# EAGLE design superprobe (EAGLE 6.6.0)
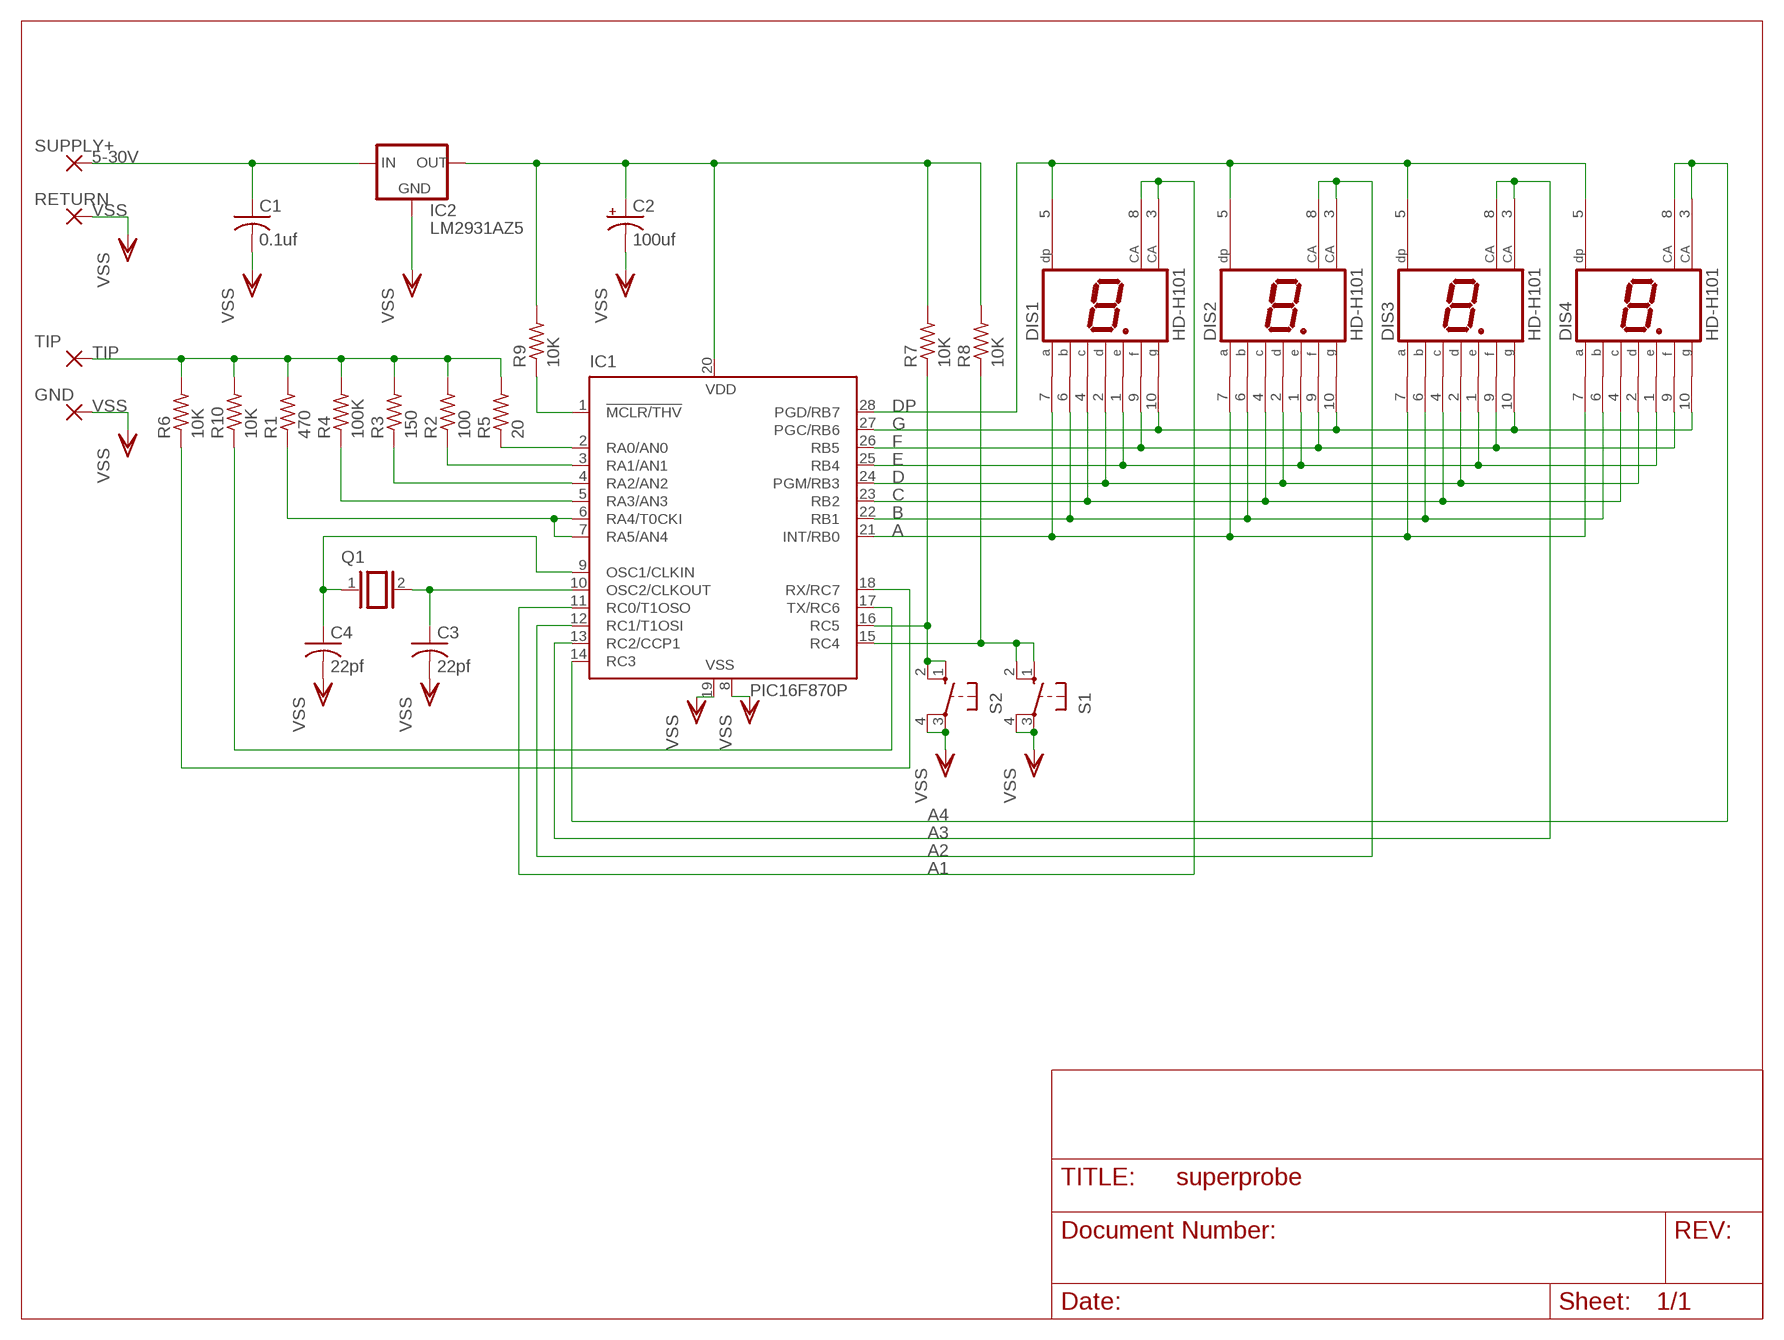
[diagram p0: schematic, sheet 1]

## Parts
C1  0.1uf  C-US050-025X075  [C050-025X075]
C2  100uf  CPOL-USE15-6AXIAL  [E15-6]
C3  22pf  C-US050-025X075  [C050-025X075]
C4  22pf  C-US050-025X075  [C050-025X075]
DIS1  HD-H101  [HDSP-M]
DIS2  HD-H101  [HDSP-M]
DIS3  HD-H101  [HDSP-M]
DIS4  HD-H101  [HDSP-M]
GND  PAD-0520  [0520]
IC1  PIC16F870P  [DIL28-3]
IC2  LM2931AZ5  XC63FPL  [TO92]
Q1  XTAL/S  [QS]
R1  470  R-US_0207/10  [0207/10]
R2  100  R-US_0207/10  [0207/10]
R3  150  R-US_0207/10  [0207/10]
R4  100K  R-US_0207/10  [0207/10]
R5  20  R-US_0207/10  [0207/10]
R6  10K  R-US_0207/10  [0207/10]
R7  10K  R-US_0207/10  [0207/10]
R8  10K  R-US_0207/10  [0207/10]
R9  10K  R-US_0207/10  [0207/10]
R10  10K  R-US_0207/10  [0207/10]
RETURN  PAD-0520  [0520]
S1  40-XX  [B3F-40XX]
S2  40-XX  [B3F-40XX]
SUPPLY+  PAD-0520  [0520]
TIP  PAD-0520  [0520]

## Nets
5-30V [supply]: C1.1 IC2.1(IN) SUPPLY+.P$1(P)
A: DIS1.7(A) DIS2.7(A) DIS3.7(A) DIS4.7(A) IC1.21(INT/RB0)
A1: DIS1.3(CA) DIS1.8(CA) IC1.11(RC0/T1OSO)
A2: DIS2.3(CA) DIS2.8(CA) IC1.12(RC1/T1OSI)
A3: DIS3.3(CA) DIS3.8(CA) IC1.13(RC2/CCP1)
A4: DIS4.3(CA) DIS4.8(CA) IC1.14(RC3)
B: DIS1.6(B) DIS2.6(B) DIS3.6(B) DIS4.6(B) IC1.22(RB1)
C: DIS1.4(C) DIS2.4(C) DIS3.4(C) DIS4.4(C) IC1.23(RB2)
D: DIS1.2(D) DIS2.2(D) DIS3.2(D) DIS4.2(D) IC1.24(PGM/RB3)
DP: DIS1.5(DP) DIS2.5(DP) DIS3.5(DP) DIS4.5(DP) IC1.28(PGD/RB7)
E: DIS1.1(E) DIS2.1(E) DIS3.1(E) DIS4.1(E) IC1.25(RB4)
F: DIS1.9(F) DIS2.9(F) DIS3.9(F) DIS4.9(F) IC1.26(RB5)
G: DIS1.10(G) DIS2.10(G) DIS3.10(G) DIS4.10(G) IC1.27(PGC/RB6)
N$1: IC1.1(!MCLR/THV) R9.1
N$2: IC1.2(RA0/AN0) R5.1
N$3: IC1.6(RA4/T0CKI) IC1.7(RA5/AN4) R1.1
N$4: IC1.5(RA3/AN3) R4.1
N$5: IC1.4(RA2/AN2) R3.1
N$6: IC1.3(RA1/AN1) R2.1
N$7: IC1.16(RC5) R7.1 S2.1(S) S2.2(S1)
N$9: IC1.15(RC4) R8.1 S1.1(S) S1.2(S1)
N$10: IC1.18(RX/RC7) R6.1
N$11: IC1.17(TX/RC6) R10.1
N$12: C4.1 IC1.9(OSC1/CLKIN) Q1.1
N$13: C3.1 IC1.10(OSC2/CLKOUT) Q1.2
TIP: R1.2 R2.2 R3.2 R4.2 R5.2 R6.2 R10.2 TIP.P$1(P)
VDD [supply]: C2.+ IC1.20(VDD) IC2.3(OUT) R7.2 R8.2 R9.2
VSS [supply]: C1.2 C2.- C3.2 C4.2 GND.P$1(P) IC1.8(VSS) IC1.19(VSS) IC2.2(GND) RETURN.P$1(P) S1.3(P) S1.4(P1) S2.3(P) S2.4(P1)

## Library data of the parts
C1 C3 C4 = rcl:C-US: CAPACITOR, American symbol
C2 = rcl:CPOL-US: POLARIZED CAPACITOR, American symbol
DIS1-DIS4 = display-hp:HD-H101: LED DISPLAY 1-character 7 segment, decimal point right; OC_FARNELL: unknown; OC_NEWARK: unknown
GND RETURN SUPPLY+ TIP = dec-con:PAD: WIRE PAD Standard US Drill Sizes
IC1 = microchip:PIC16*870: MICROCONTROLLER flash type; MF: MICROCHIP; MPN: PIC16F870-I/SP; OC_FARNELL: 9760954; OC_NEWARK: 19C7275
IC2 = v-reg:XC63FP: Positiv Voltage Regulators www.torex.co.jp/english/product/pro02/pdf/0201_xc62fp.pdf
Q1 = special:XTAL/S: CRYSTAL
R1-R10 = rcl:R-US_: RESISTOR, American symbol
S1 S2 = switch-omron:40-XX: OMRON SWITCH; MF: OMRON COMPONENTS USA; MPN: B3F-4000; OC_FARNELL: 176434; OC_NEWARK: 36K3105

## Net classes
1 supply: width 0.508 mm

## Board
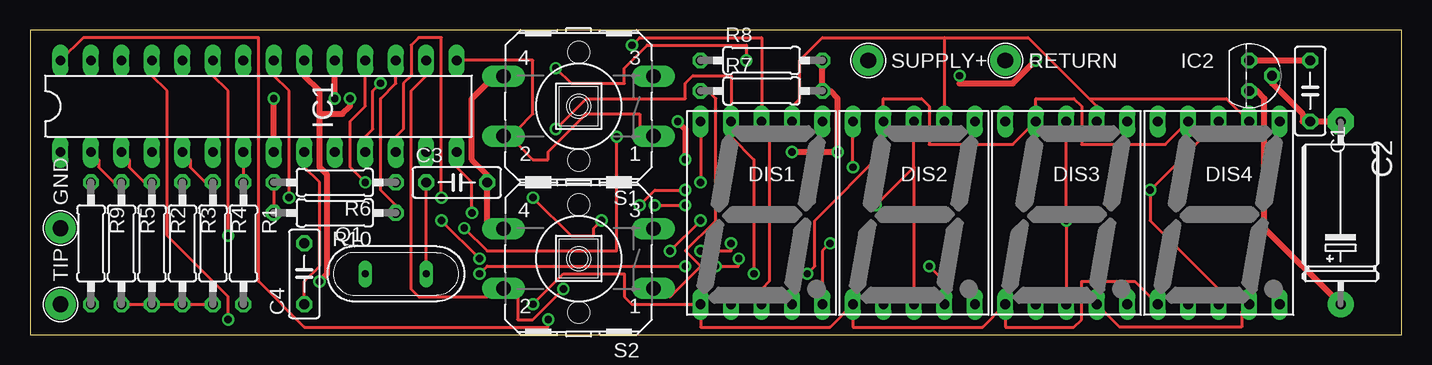
[diagram p1: board, top side]
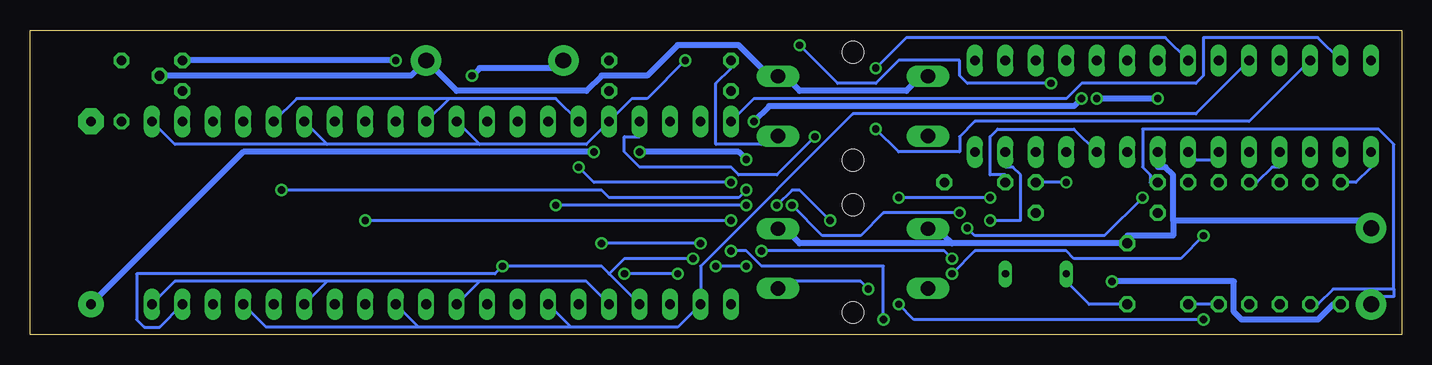
[diagram p2: board, bottom side, seen from below]

Size 114.3 x 25.4 mm. Coordinates in mm from the lower left corner, seen from the top.
Outline: 0,0 114.3,0 114.3,25.4 0,25.4 0,0
Copper layers (1*16): Top 0.035mm / dielectric 1.5mm / Bottom 0.035mm
Design rules "default": minimum track width 10mil, minimum drill 24mil, track to track 8mil, track to pad 8mil, pad to pad 8mil, via to via 8mil, smd to smd 8mil, copper to edge 20mil, drill to drill 8mil, minimum pad ring 10mil, minimum via ring 8mil, stop-mask expansion 4mil, vias tented up to drill 0mil, thermal gap 10mil

### Footprints (pad centres in the part's own frame; a part is rotated, then mirrored left to right if it is on the bottom)
C050-025X075 = drill 0.813 octagon: 1 -2.54,0; 2 2.54,0
E15-6 = drill 0.813 pad 2.159: + -7.62,0 | drill 0.813 pad 2.159 octagon: - 7.62,0
HDSP-M = drill 0.813 long: 1 -5.08,-7.62; 2 -2.54,-7.62; 3 0,-7.62; 4 2.54,-7.62; 5 5.08,-7.62; 6 5.08,7.62; 7 2.54,7.62; 8 0,7.62; 9 -2.54,7.62; 10 -5.08,7.62
0520 = drill 1.321 pad 2.54: P$1 0,0
DIL28-3 = drill 0.813 long: 1 -16.51,-3.81; 2 -13.97,-3.81; 3 -11.43,-3.81; 4 -8.89,-3.81; 5 -6.35,-3.81; 6 -3.81,-3.81; 7 -1.27,-3.81; 8 1.27,-3.81; 9 3.81,-3.81; 10 6.35,-3.81; 11 8.89,-3.81; 12 11.43,-3.81; 13 13.97,-3.81; 14 16.51,-3.81; 15 16.51,3.81; 16 13.97,3.81; 17 11.43,3.81; 18 8.89,3.81; 19 6.35,3.81; 20 3.81,3.81; 21 1.27,3.81; 22 -1.27,3.81; 23 -3.81,3.81; 24 -6.35,3.81; 25 -8.89,3.81; 26 -11.43,3.81; 27 -13.97,3.81; 28 -16.51,3.81
TO92 = drill 0.813 octagon: 1 -1.27,0; 2 0,1.905; 3 1.27,0
QS = drill 0.61 long: 1 -2.54,0; 2 2.54,0
0207/10 = drill 0.813 octagon: 1 -5.08,0; 2 5.08,0
B3F-40XX = drill 1.194 long: 1 -6.248,2.489; 2 6.248,2.489; 3 -6.248,-2.489; 4 6.248,-2.489 | hole 1.803: 0,-4.496; 0,4.496

### Placement (x,y rotation side)
C1  106.68,20.32 270 top
C2  109.22,10.16 90 top
C3  35.56,12.7 0 top
C4  22.86,5.08 90 top
DIS1  60.96,10.16 0 top
DIS2  73.66,10.16 0 top
DIS3  86.36,10.16 0 top
DIS4  99.06,10.16 0 top
GND  2.54,8.89 90 top
IC1  19.05,19.05 0 top
IC2  101.6,21.59 270 top
Q1  30.48,5.08 0 top
R1  17.78,7.62 270 top
R2  10.16,7.62 270 top
R3  12.7,7.62 270 top
R4  15.24,7.62 270 top
R5  7.62,7.62 270 top
R6  25.4,12.7 180 top
R7  60.96,20.32 0 top
R8  60.96,22.86 0 top
R9  5.08,7.62 270 top
R10  25.4,10.16 180 top
RETURN  81.28,22.86 0 top
S1  45.72,19.05 180 top
S2  45.72,6.35 180 top
SUPPLY+  69.85,22.86 0 top
TIP  2.54,2.54 90 top

### Tracks (layer width: path | path; a pad name or v marks a point on that pad's centre or on a via)
5-30V  (via drill 0.61)
  Top 0.508: IC2.1 C1.1 | v83.82,22.86 81.92,20.95 77.47,20.95 v77.47,21.59
  Bottom 0.508: v77.47,21.59 76.83,22.23 70.48,22.23 SUPPLY+.P$1 | v83.82,22.86 IC2.1
A  (via drill 0.61)
  Top 0.254: 76.2,24.77 66.04,24.77 64.14,22.86 64.14,19.68 63.5,19.05 DIS1.7 | 76.2,24.77 DIS2.7 | v21.59,11.43 21.59,20.32 20.32,21.59 IC1.21 | v36.2,8.89 38.1,6.99 48.9,6.99 v48.9,16.51 | 88.27,19.68 83.19,24.77 76.2,24.77 | 88.27,19.68 88.9,19.05 DIS3.7 | 88.27,19.68 99.69,19.68 DIS4.7
  Bottom 0.254: v21.59,11.43 24.77,8.26 35.56,8.26 v36.2,8.89 | v48.9,16.51 52.07,13.34 55.24,13.34 55.88,13.97 63.5,13.97 64.77,15.24 64.77,16.51 63.5,16.51 DIS1.7
A1  (via drill 0.61)
  Top 0.254: v29.21,20.95 28.57,20.32 28.57,17.14 27.94,16.51 IC1.11 | v50.16,24.13 50.8,24.77 60.96,24.77 DIS1.8 61.59,17.14 61.59,4.45 60.96,3.81 DIS1.3
  Bottom 0.254: v29.21,20.95 36.2,20.95 36.83,21.59 36.83,22.86 41.91,22.86 43.81,20.95 46.99,20.95 v50.16,24.13
A2  (via drill 0.61)
  Top 0.254: v34.29,11.43 34.29,24.77 32.38,24.77 31.75,24.13 31.75,21.59 31.11,20.95 31.11,17.14 30.48,16.51 IC1.12 | v41.91,11.43 45.09,8.26 46.99,8.26 46.99,8.89 v47.62,9.53 | v52.07,10.79 v54.61,10.79 | v70.48,10.79 73.66,13.97 | 73.66,13.97 DIS2.8 | 73.66,13.97 DIS2.3
  Bottom 0.254: v34.29,11.43 v41.91,11.43 | v47.62,9.53 50.16,12.06 50.8,12.06 v52.07,10.79 | v54.61,10.79 v70.48,10.79
A3  (via drill 0.61)
  Top 0.254: v34.29,9.53 v37.47,6.35 | v53.34,6.99 v55.88,9.53 | DIS3.3 v86.36,9.53 DIS3.8
  Bottom 0.254: v34.29,9.53 31.75,9.53 31.75,13.34 32.38,13.97 33.02,13.97 IC1.13 | v37.47,6.35 38.1,6.99 v53.34,6.99 | v55.88,9.53 v86.36,9.53
A4  (via drill 0.61)
  Top 0.254: v36.83,10.16 36.83,12.7 35.56,13.97 IC1.14 | v50.8,10.79 52.07,12.06 v54.61,12.06 | DIS4.8 v93.34,12.06 93.34,9.53 99.06,3.81 DIS4.3
  Bottom 0.254: v36.83,10.16 43.18,10.16 45.09,8.26 48.26,8.26 v50.8,10.79 | v54.61,12.06 55.24,11.43 66.04,11.43 66.67,12.06 v93.34,12.06
B  (via drill 0.61)
  Top 0.254: v43.81,22.23 45.09,20.95 49.53,20.95 49.53,22.23 51.44,24.13 59.69,24.13 v59.69,22.86
  Bottom 0.254: 76.83,15.88 67.94,15.88 DIS1.6 64.14,19.68 62.87,19.68 v59.69,22.86 | 76.83,15.88 DIS2.6 | 76.83,15.88 89.53,15.88 | 89.53,15.88 DIS3.6 | 89.53,15.88 102.23,15.88 DIS4.6 | v43.81,22.23 41.27,24.77 19.68,24.77 IC1.22
C  (via drill 0.61)
  Top 0.254: DIS3.4 90.81,0.64 100.97,0.64 100.97,1.91 DIS4.4 | v74.93,5.71 76.2,4.45 DIS2.4 | v16.51,8.26 16.51,20.32 15.24,21.59 IC1.23 | v37.47,5.08 38.1,5.71 v54.61,5.71 | v57.15,5.71 59.05,5.71 v59.05,6.35
  Bottom 0.254: 66.04,5.08 66.67,5.71 v74.93,5.71 75.56,5.08 105.41,5.08 105.41,1.27 104.78,0.64 103.5,0.64 DIS4.4 | 66.04,5.08 DIS1.4 | v16.51,8.26 18.41,6.35 27.3,6.35 27.94,6.99 35.56,6.99 v37.47,5.08 | v54.61,5.71 v57.15,5.71 | v59.05,6.35 64.77,6.35 66.04,5.08
D
  Bottom 0.254: 69.22,0.64 60.33,0.64 DIS1.2 58.42,5.71 45.72,18.41 17.14,18.41 IC1.24 | 69.22,0.64 DIS2.2 | 69.22,0.64 81.92,0.64 | 81.92,0.64 DIS3.2 | 81.92,0.64 94.61,0.64 DIS4.2
DP  (via drill 0.61)
  Top 0.254: v43.18,1.27 43.18,0.64 22.86,0.64 19.05,4.45 19.05,24.77 4.45,24.77 IC1.28 | v55.88,6.99 58.42,6.99 v58.42,7.62 | v66.67,7.62 66.04,6.99 DIS1.5
  Bottom 0.254: 76.83,4.45 67.94,4.45 DIS1.5 | 76.83,4.45 DIS2.5 | 76.83,4.45 89.53,4.45 | 89.53,4.45 DIS3.5 | 89.53,4.45 102.23,4.45 DIS4.5 | v43.18,1.27 43.18,5.71 53.34,5.71 54.61,6.99 v55.88,6.99 | v58.42,7.62 v66.67,7.62
E  (via drill 0.61)
  Top 0.254: v16.51,1.27 16.51,3.17 11.43,8.26 11.43,20.32 10.16,21.59 IC1.25 | v41.91,2.54 44.45,5.08 49.53,5.08 49.53,3.17 50.16,2.54 DIS1.1 55.88,0.64 66.67,0.64 DIS2.1 68.58,0.64 79.38,0.64 DIS3.1 81.28,0.64 87,0.64 87.63,1.27 87.63,4.45 92.08,4.45 DIS4.1
  Bottom 0.254: v16.51,1.27 40.64,1.27 v41.91,2.54
F  (via drill 0.61)
  Top 0.254: v60.33,5.08 60.33,14.61 58.42,16.51 DIS1.9 58.42,21.59 55.24,21.59 54.61,20.95 54.61,19.68 46.35,19.68 v43.81,17.14 | v64.77,5.08 65.41,5.71 65.41,9.53 71.12,15.24 DIS2.9 71.12,19.68 74.3,19.68 74.93,19.05 74.93,15.88 81.92,15.88 DIS3.9 83.82,19.68 87,19.68 87.63,19.05 87.63,15.88 94.61,15.88 DIS4.9
  Bottom 0.254: v60.33,5.08 v64.77,5.08 | v43.81,17.14 41.91,15.24 36.83,15.24 36.83,16.51 35.56,17.78 12.7,17.78 IC1.26
G  (via drill 0.61)
  Top 0.254: v68.58,13.97 DIS2.10 | DIS1.10 v55.88,12.7
  Bottom 0.254: 79.38,19.68 70.48,19.68 DIS2.10 | 79.38,19.68 DIS3.10 | 79.38,19.68 92.08,19.68 DIS4.10 | DIS1.10 53.98,19.68 27.94,19.68 26.67,20.95 17.14,20.95 16.51,21.59 16.51,24.77 6.99,24.77 IC1.27 | v68.58,13.97 67.31,12.7 v55.88,12.7
N$1
  Bottom 0.254: IC1.1 2.54,13.97 3.81,12.7 R9.1
N$2
  Top 0.254: R5.1 6.99,12.7 5.71,13.97 5.71,14.61 IC1.2
N$3
  Top 0.254: IC1.7 R1.1
  Bottom 0.254: IC1.6 15.88,14.61 17.14,14.61 IC1.7
N$4
  Top 0.254: R4.1 14.61,12.7 13.34,13.97 13.34,14.61 IC1.5
N$5
  Bottom 0.254: R3.1 12.06,12.7 10.79,13.97 10.16,13.97 IC1.4
N$6
  Top 0.254: R2.1 9.53,12.7 8.26,13.97 8.26,14.61 IC1.3
N$7  (via drill 0.61)
  Top 0.254: R7.1 56.52,20.32 57.15,19.68 57.15,9.53 54.61,6.99 55.88,5.71 53.34,3.17 S2.1 | IC1.16 33.02,21.59 31.75,20.32 31.75,3.81 32.38,3.17 38.1,3.17 S2.2 40.64,3.17 40.64,1.27 41.91,1.27 v44.45,3.81
  Bottom 0.254: v44.45,3.81 45.09,4.45 50.8,4.45 S2.1
N$9
  Top 0.254: IC1.15 41.91,22.86 41.91,18.41 40.64,17.14 S1.2 40.64,15.88 41.91,14.61 43.18,14.61 43.18,15.24 46.35,18.41 50.8,18.41 50.8,17.14 S1.1
  Bottom 0.254: R8.1 55.88,22.23 57.15,20.95 57.15,15.88 53.34,15.88 S1.1
N$10  (via drill 0.61)
  Top 0.254: v27.94,12.7 26.67,13.97 26.67,17.78 27.94,19.05 IC1.18
  Bottom 0.254: v27.94,12.7 R6.1
N$11
  Top 0.254: R10.1 30.48,10.79 29.21,12.06 29.21,19.68 30.48,20.95 IC1.17
N$12
  Top 0.254: IC1.9 22.86,13.97 24.13,12.7 24.13,5.71 22.86,4.45 C4.1
  Bottom 0.254: Q1.1 27.94,4.45 26.04,2.54 C4.1
N$13
  Top 0.254: Q1.2 C3.1
  Bottom 0.254: IC1.10 27.3,17.14 33.66,17.14 34.29,16.51 34.29,13.34 33.02,13.34 C3.1
TIP
  Top 0.254: R5.2 R2.2 R3.2 R4.2 | R6.2 R10.2
  Bottom 0.254: R4.2 R1.2 | 0.64,3.81 0.64,3.17 1.91,3.17 TIP.P$1 | 0.64,3.81 0.64,15.88 1.91,17.14 21.59,17.14 21.59,13.97 20.95,13.34 20.95,12.7 R6.2 | 0.64,3.81 5.71,3.81 6.99,2.54 R5.2
VDD  (via drill 0.61)
  Top 0.508: v24.13,4.45 24.77,5.08 24.77,13.34 24.13,13.97 24.13,18.41 | 24.13,18.41 24.13,20.32 22.86,21.59 IC1.20 | R8.2 R7.2 66.67,20.32 67.31,19.68 v67.31,15.24 v63.5,15.24 | IC2.3 102.23,20.32 102.87,19.68 102.87,8.89 C2.+ | 24.13,18.41 26.04,18.41 26.67,19.05 v26.67,19.68 | v53.98,17.78 54.61,17.14 v54.61,14.61
  Bottom 0.508: v24.13,4.45 13.97,4.45 13.97,1.91 13.34,1.27 6.99,1.27 5.71,2.54 R9.2 | v67.31,15.24 96.52,15.24 C2.+ | v26.67,19.68 27.3,19.05 52.7,19.05 v53.98,17.78 | v54.61,14.61 55.24,15.24 v63.5,15.24
VSS  (via drill 0.61)
  Top 0.508: C2.- C1.2 106.05,17.78 106.05,18.41 103.5,20.95 IC2.2 | v25.4,19.68 IC1.19 | IC1.8 v20.32,19.68 | S2.4 38.1,9.53 C3.2 38.1,13.34 36.83,14.61 36.83,19.68 38.1,20.95 S1.4
  Bottom 0.508: IC2.2 82.55,21.59 RETURN.P$1 78.74,20.32 67.94,20.32 66.67,21.59 62.87,21.59 60.33,24.13 55.24,24.13 53.34,22.23 S1.3 50.8,20.95 50.16,20.32 41.27,20.32 40.64,20.95 S1.4 | 37.47,7.62 38.1,8.26 S2.4 | 37.47,7.62 C4.2 22.86,8.26 19.05,8.26 19.05,9.53 | 19.05,9.53 19.05,13.34 19.68,13.97 20.32,13.97 IC1.8 | v20.32,19.68 v25.4,19.68 | 37.47,7.62 50.16,7.62 50.8,8.26 S2.3 | 19.05,9.53 3.17,9.53 GND.P$1